# EAGLE board ARK (EAGLE 9.4.2)
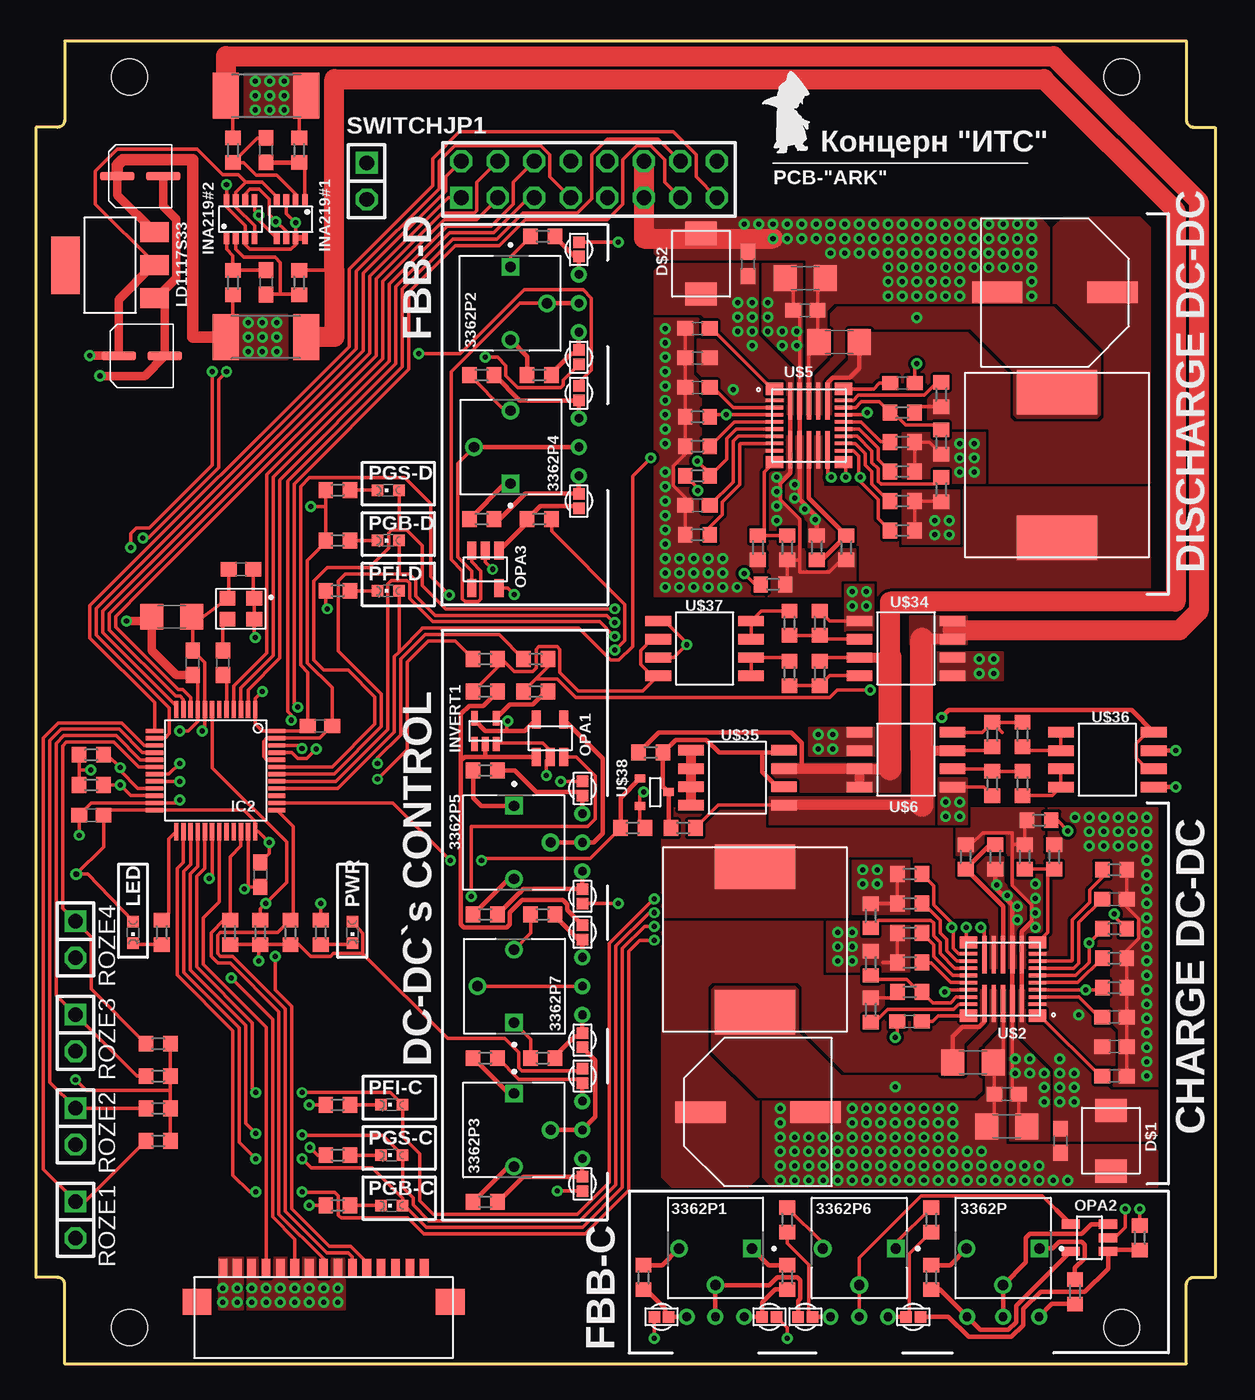
[diagram p5: board, top side]
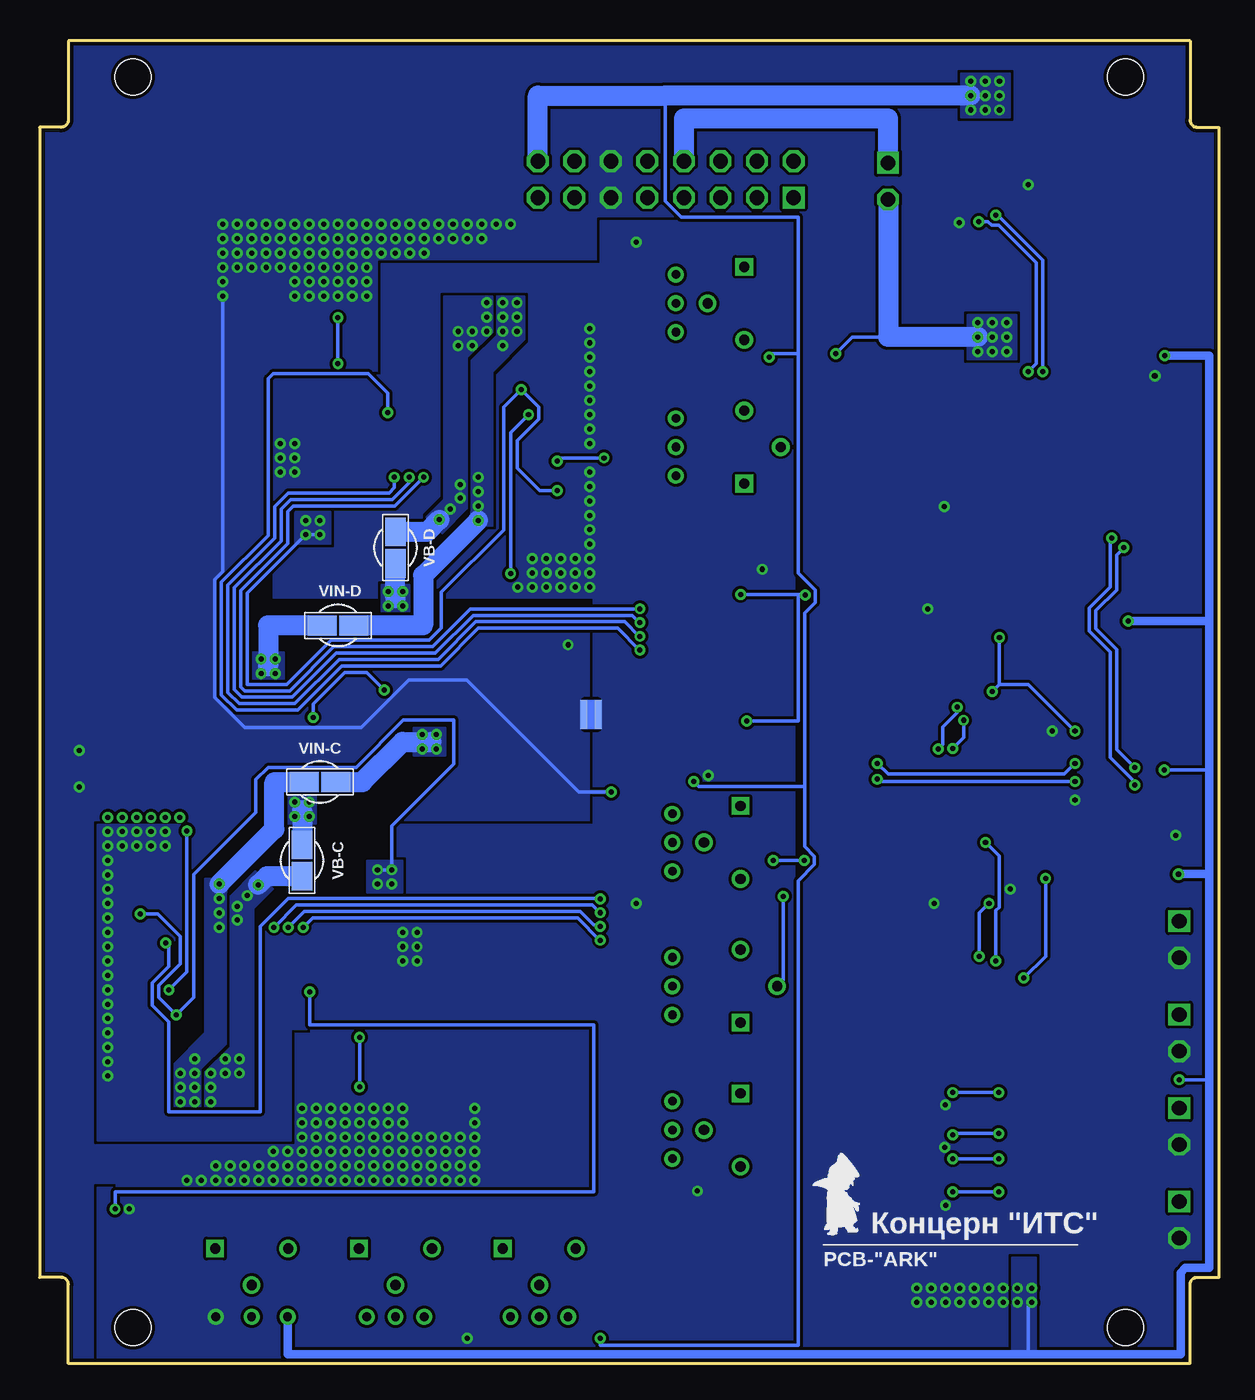
[diagram p6: board, bottom side, seen from below]

Size 82 x 92 mm. Coordinates in mm from the lower left corner, seen from the top.
Outline: 2,92 80,92 80,86.5 arc90 80.5,86 82,86 82,6 80.5,6 arc90 80,5.5 80,0 2,0 2,5.5 arc90 1.5,6 0,6 0,86 1.5,86 arc90 2,86.5 2,92
Copper layers (1*16): Top 0.035mm / dielectric 1.5mm / Bottom 0.035mm
Design rules "default *": minimum track width 0.25mm, minimum drill 0.35mm, track to track 0.2mm, track to pad 0.2mm, pad to pad 0.2mm, via to via 0.2mm, smd to smd 0.2mm, copper to edge 0.25mm, drill to drill 0.2mm, minimum pad ring 10mil, minimum via ring 8mil, stop-mask expansion 4mil, vias tented up to drill 0mil, thermal gap 10mil
Holes 2.5 mm at 6.5,2.5 75.5,2.5 75.5,89.5 6.5,89.5

## Footprints (pad centres in the part's own frame; a part is rotated, then mirrored left to right if it is on the bottom)
TRIM_3362P-1-502LF = drill 0.714 square: 1 -2.54,0 | drill 0.714: 2 0,2.54; 3 2.54,0
C0603 = smd 1.1 x 1: 1 -0.85,0; 2 0.85,0
C1206 = smd 1.6 x 1.8: 1 -1.4,0; 2 1.4,0
ECAP-SMD-D4 = smd 0.6 x 2.4: P+ 0,1.6; P- 0,-1.6
ECAP1000-CMD = smd 1.5 x 3.5: P$1 0,4; P$2 0,-4
SMB = smd 1.62 x 2.18: P$1 -2.11,0; P$2 2.11,0
LQFP48 = smd 0.3 x 1.2: 1 -2.75,-4.25; 2 -2.25,-4.25; 3 -1.75,-4.25; 4 -1.25,-4.25; 5 -0.75,-4.25; 6 -0.25,-4.25; 7 0.25,-4.25; 8 0.75,-4.25; 9 1.25,-4.25; 10 1.75,-4.25; 11 2.25,-4.25; 12 2.75,-4.25; 25 2.75,4.25; 26 2.25,4.25; 27 1.75,4.25; 28 1.25,4.25; 29 0.75,4.25; 30 0.25,4.25; 31 -0.25,4.25; 32 -0.75,4.25; 33 -1.25,4.25; 34 -1.75,4.25; 35 -2.25,4.25; 36 -2.75,4.25 | smd 1.2 x 0.3: 13 4.25,-2.75; 14 4.25,-2.25; 15 4.25,-1.75; 16 4.25,-1.25; 17 4.25,-0.75; 18 4.25,-0.25; 19 4.25,0.25; 20 4.25,0.75; 21 4.25,1.25; 22 4.25,1.75; 23 4.25,2.25; 24 4.25,2.75; 37 -4.25,2.75; 38 -4.25,2.25; 39 -4.25,1.75; 40 -4.25,1.25; 41 -4.25,0.75; 42 -4.25,0.25; 43 -4.25,-0.25; 44 -4.25,-0.75; 45 -4.25,-1.25; 46 -4.25,-1.75; 47 -4.25,-2.25; 48 -4.25,-2.75
SOT23-8 = smd 0.9 x 0.4: 1 -1.3,0.975; 2 -1.3,0.325; 3 -1.3,-0.325; 4 -1.3,-0.975; 5 1.3,-0.975; 6 1.3,-0.325; 7 1.3,0.325; 8 1.3,0.975
SC70 = smd 0.47 x 1: P$1 -0.75,-0.9; P$2 0,-0.9; P$3 0.75,-0.9; P$4 0.75,0.9; P$5 -0.75,0.9
2X08 = drill 1.016 square: 1 -8.89,-1.27 | drill 1.016 octagon: 2 -8.89,1.27; 3 -6.35,-1.27; 4 -6.35,1.27; 5 -3.81,-1.27; 6 -3.81,1.27; 7 -1.27,-1.27; 8 -1.27,1.27; 9 1.27,-1.27; 10 1.27,1.27; 11 3.81,-1.27; 12 3.81,1.27; 13 6.35,-1.27; 14 6.35,1.27; 15 8.89,-1.27; 16 8.89,1.27
L_12X12 = smd 3.1 x 5.6: P$1 -5.05,0; P$2 5.05,0
SOT223 = smd 4 x 2: P$1 0,3.1 | smd 1.4 x 2: P$2 -2.29,-3.1; P$3 0,-3.1; P$4 2.29,-3.1
CHIPLED_0603 = smd 0.8 x 0.8: A 0,-0.75; C 0,0.75
SOT23-5 = smd 0.635 x 1.27: P$1 -0.95,-1.3; P$2 0,-1.3; P$3 0.95,-1.3; P$4 0.95,1.3; P$5 -0.95,1.3
R0603 = smd 1 x 1.1: 1 -0.85,0; 2 0.85,0
R2512 = smd 1.8 x 3.2: 1 -2.8,0; 2 2.8,0
1X02 = drill 1.016 square: 1 -1.27,0 | drill 1.016 octagon: 2 1.27,0
OC2E08000XCCDRX = smd 1.1 x 1: P$1 0.925,0.725; P$2 -0.925,0.725; P$3 -0.925,-0.725; P$4 0.925,-0.725
SOLDERING-PAD-4A = smd 2 x 1.4: P$1 1.1,0; P$2 -1.1,0
QFN-30 = smd 1.2 x 0.85: 1 -2.4,2.55; 10 -2.4,-2.55; 16 2.4,-2.55; 25 2.4,2.55 | smd 1.2 x 0.25: 2 -2.4,1.75; 3 -2.4,1.25; 4 -2.4,0.75; 5 -2.4,0.25; 6 -2.4,-0.25; 7 -2.4,-0.75; 8 -2.4,-1.25; 9 -2.4,-1.75; 17 2.4,-1.75; 18 2.4,-1.25; 19 2.4,-0.75; 20 2.4,-0.25; 21 2.4,0.25; 22 2.4,0.75; 23 2.4,1.25; 24 2.4,1.75 | smd 0.3 x 2.6: 11 -1.3,-1.7; 12 -0.65,-1.7; 13 0,-1.7; 14 0.65,-1.7; 15 1.3,-1.7; 26 1.3,1.7; 27 0.65,1.7; 28 0,1.7; 29 -0.65,1.7; 30 -1.3,1.7
SO8 = smd 0.72 x 1.78: 1 -1.905,-3.23; 2 -0.635,-3.23; 3 0.635,-3.23; 4 1.905,-3.23; 5 1.905,3.23; 6 0.635,3.23; 7 -0.635,3.23; 8 -1.905,3.23
GNDS-CONNECTOR = smd 0.5 x 2: P$1 -0.5,0; P$2 0.5,0
VIAS = drill 0.6: P$1 0,0
68611 = smd 0.6 x 1.3: P$1 -7,0.65; P$2 -6,0.65; P$3 -5,0.65; P$4 -4,0.65; P$5 -3,0.65; P$6 -2,0.65; P$7 -1,0.65; P$8 0,0.65; P$9 1,0.65; P$10 2,0.65; P$11 3,0.65; P$12 4,0.65; P$13 5,0.65; P$14 6,0.65; P$15 7,0.65 | smd 2 x 1.8: P$16 8.8,-1.7; P$17 -8.8,-1.7
VIAS-CONNECT = smd 0.8 x 0.8: 1 -0.5,0; 2 0.5,0
SOT23-3 = smd 0.56 x 0.73: 1 -0.95,-1; 2 0.95,-1; 3 0,1

## Placement (x,y rotation side)
3362P  1k  [TRIM_3362P-1-502LF]  67.25,8 180 top
3362P1  1k  [TRIM_3362P-1-502LF]  47.25,8 180 top
3362P2  5k  [TRIM_3362P-1-502LF]  33,73.75 270 top
3362P3  500R  [TRIM_3362P-1-502LF]  33.25,16.25 270 top
3362P4  1k  [TRIM_3362P-1-502LF]  33,63.75 90 top
3362P5  5k  [TRIM_3362P-1-502LF]  33.25,36.25 270 top
3362P6  20k  [TRIM_3362P-1-502LF]  57.25,8 180 top
3362P7  20k  [TRIM_3362P-1-502LF]  33.25,26.25 90 top
C1  1nF  [C0603]  13,48.75 90 top
C1.C  100nF  [C0603]  71.25,15.5 90 top
C1.D  100nF  [C0603]  49.5,76.5 270 top
C2  10nF  [C0603]  14.25,55.25 0 top
C2A.C  22µF  [C1206]  67.5,16.5 180 top
C2A.D  22µF  [C1206]  53.5,75.5 0 top
C2B.C  100nF  [C0603]  67.5,18.75 180 top
C2B.D  100nF  [C0603]  53.5,73.25 0 top
C3.C  1µF  [C0603]  75,22.05 0 top
C3.D  1µF  [C0603]  46,69.95 180 top
C4  10uF  [ECAP-SMD-D4]  7.35,70.1 90 top
C4A.C  1µF  [C1206]  65.15,20.95 180 top
C4A.D  1µF  [C1206]  55.85,71.05 0 top
C4B.C  1000µF  [ECAP1000-CMD]  50.2,17.5 90 top
C4B.D  1000µF  [ECAP1000-CMD]  70.85,74.5 270 top
C5  100nF  [C0603]  19.75,44.35 0 top
C5.C  1µF  [C0603]  60.75,23.8 0 top
C5.D  1µF  [C0603]  60.25,68.2 180 top
C6  100nF  [C0603]  10.9,48.75 90 top
C6.C  10nF  [C0603]  75,20 0 top
C6.D  10nF  [C0603]  46,72 180 top
C7  100nF  [C0603]  3.85,38.15 180 top
C7.C  (10nF)  [C0603]  75,24.1 0 top
C7.D  (10nF)  [C0603]  46,67.9 180 top
C8  100nF  [C0603]  15.6,34 270 top
C8.C  (10nF)  [C0603]  75,32.3 0 top
C8.D  (10nF)  [C0603]  46,59.7 180 top
C9  0,1µ  [C0603]  16,84.4 90 top
C10  0,1µ  [C0603]  16,75.2 270 top
C11  1uF  [ECAP-SMD-D4]  7.25,82.6 90 top
C16  10µ  [C1206]  9.45,51.95 0 top
D$1  SMP100LC-8  [SMB]  74.75,15.5 90 top
D$2  SMP100LC-8  [SMB]  46.25,76.5 270 top
IC2  STM32F103C8T  [LQFP48]  12.5,41.25 180 top
INA219#1  INA219AID  [SOT23-8]  17.73,79.6 270 top
INA219#2  INA219AID  [SOT23-8]  14.22,79.6 90 top
INVERT1  INVERTER.  [SC70]  31.25,44 0 top
JP1  [2X08]  38.46,82.37 0 top
L1.C  10µH  [L_12X12]  50,29.5 90 top
L1.D  10µH  [L_12X12]  71,62.5 270 top
LD1117S33  LD1117S33  [SOT223]  5.15,76.4 90 top
LED  [CHIPLED_0603]  6.75,30 180 top
OPA1  OPA333  [SOT23-5]  35.75,43.5 0 top
OPA2  OPA333  [SOT23-5]  73.25,8.75 90 top
OPA3  OPA333  [SOT23-5]  31.25,55.25 180 top
PFI-C  [CHIPLED_0603]  24.75,18 90 top
PFI-D  [CHIPLED_0603]  24.5,53.75 90 top
PGB-C  [CHIPLED_0603]  24.75,11 90 top
PGB-D  [CHIPLED_0603]  24.5,57.25 90 top
PGS-C  [CHIPLED_0603]  24.75,14.5 90 top
PGS-D  [CHIPLED_0603]  24.5,60.75 90 top
PWR  [CHIPLED_0603]  22,30 180 top
R1  10k  [R0603]  34.75,46.75 180 top
R1.C  62k  [R0603]  68.75,35.25 270 top
R1.D  62k  [R0603]  52.25,56.75 90 top
R2  10k  [R0603]  8.5,15.5 0 top
R2.C  10k  [R0603]  70.8,35.25 90 top
R2.D  10k  [R0603]  50.2,56.75 270 top
R3  100  [R0603]  34.75,49 0 top
R4  100  [R0603]  52.4,48 90 top
R5  100  [R0603]  52.4,51.5 90 top
R5.C  191k  [R0603]  60.75,25.85 0 top
R5.D  191k  [R0603]  60.25,66.15 180 top
R6  10k  [R0603]  8.5,17.75 0 top
R6.C  10k  [R0603]  58.05,27.85 90 top
R6.D  10k  [R0603]  62.95,64.1 270 top
R7  100  [R0603]  68.6,43.75 90 top
R7.C  17k8  [R0603]  75,34.35 180 top
R7.D  17k8  [R0603]  46,57.65 0 top
R8  10k  [R0603]  8.5,20 0 top
R8.C  (10k)  [R0603]  58.05,24.6 270 top
R8.D  (10k)  [R0603]  62.95,67.4 90 top
R9  10k  [R0603]  52.25,10 90 top
R9.C  200k  [R0603]  69.75,37.8 0 top
R9.D  200k  [R0603]  51.25,54.2 180 top
R10  10k  [R0603]  62.25,10 270 top
R10.C  11k  [R0603]  75,26.15 0 top
R10.D  11k  [R0603]  46,65.85 180 top
R11  34k8  [R0603]  62.25,6 270 top
R11.C  100k  [R0603]  64.65,35.25 90 top
R11.D  100k  [R0603]  56.35,56.75 270 top
R12  10k  [R0603]  72.25,5 90 top
R12.C  100k  [R0603]  66.7,35.25 90 top
R12.D  100k  [R0603]  54.3,56.75 270 top
R13  91k  [R0603]  42.25,6 270 top
R13.C  100k  [R0603]  75,28.2 180 top
R13.D  100k  [R0603]  46,63.8 0 top
R14  10k  [R0603]  52.25,6 90 top
R14.C  100k  [R0603]  75,30.25 180 top
R14.D  100k  [R0603]  46,61.75 0 top
R15  10k  [R0603]  76.75,8.75 90 top
R15.C  100k  [R0603]  60.75,34.05 180 top
R15.D  100k  [R0603]  60.25,57.95 0 top
R16  2k  [R0603]  21,18 0 top
R16.C  10k  [R0603]  60.75,32 180 top
R16.D  10k  [R0603]  60.25,60 0 top
R17  2k  [R0603]  21,14.5 0 top
R17.C  10k  [R0603]  58.05,31.15 90 top
R17.D  10k  [R0603]  62.95,60.8 270 top
R18  2k  [R0603]  21,11 0 top
R18.C  51k  [R0603]  60.75,27.9 180 top
R18.D  51k  [R0603]  60.25,64.1 0 top
R19  51k  [R0603]  31,68.75 180 top
R19.C  (1M)  [R0603]  60.75,29.95 180 top
R19.D  (1M)  [R0603]  60.25,62.05 0 top
R20  51k  [R0603]  35,68.75 0 top
R21  10k  [R0603]  35.25,78.4 180 top
R22  2k  [R0603]  31,58.75 0 top
R23  2k  [R0603]  21,53.75 0 top
R24  2k  [R0603]  21,60.75 0 top
R25  10k  [R0603]  35,58.75 0 top
R26  2k  [R0603]  21,57.25 0 top
R27  10k  [R0603]  17.7,30 90 top
R28  100  [R0603]  68.6,40.35 90 top
R29  10k  [R0603]  66.5,43.75 90 top
R31  10k  [R0603]  66.5,40.35 90 top
R34  10k  [R0603]  54.5,48 270 top
R35  10k  [R0603]  54.5,51.5 270 top
R38  10k  [R0603]  31.25,46.75 0 top
R39  100  [R0603]  31.25,49 180 top
R40  10k  [R0603]  42.75,42.5 0 top
R41  10k  [R0603]  45,37.25 180 top
R42  10k  [R0603]  41.5,37.25 180 top
R43  2k  [R0603]  31.25,11.25 0 top
R44  1k  [R0603]  31.25,21.25 180 top
R45  10k  [R0603]  31.25,31.25 0 top
R46  24k9  [R0603]  31.25,41.25 180 top
R47  620k  [R0603]  35.25,31.25 180 top
R48  10k  [R0603]  35.25,21.25 0 top
R49  10k  [R0603]  8.5,22.25 0 top
R64  10k  [R0603]  13.5,30 90 top
R71  R01  [R2512]  16,88.2 0 top
R73  10R  [R0603]  18.3,84.4 270 top
R74  10R  [R0603]  13.7,84.4 270 top
R75  R01  [R2512]  16,71.4 180 top
R76  10R  [R0603]  13.7,75.2 90 top
R77  10R  [R0603]  18.3,75.2 270 top
R79  10k  [R0603]  15.6,30 90 top
R81  2k  [R0603]  8.75,30 270 top
R82  2k  [R0603]  19.8,30 270 top
R101  5k1  [R0603]  3.85,42.35 0 top
R102  5k1  [R0603]  3.85,40.25 0 top
ROZE1  [1X02]  2.75,10 270 top
ROZE2  [1X02]  2.75,16.5 270 top
ROZE3  [1X02]  2.75,23 270 top
ROZE4  [1X02]  2.75,29.5 270 top
SWITCH  [1X02]  23,82.25 270 top
TCXO  OC2E08000XCCDRX  [OC2E08000XCCDRX]  14.25,52.5 0 top
U$1  VIN-C  [SOLDERING-PAD-4A]  62.5,40.45 0 bottom
U$2  MP5515  [QFN-30]  67.25,26.75 180 top
U$3  PCB-"ARK"  [ITS-LOGO]  51.25,83.5 0 top
U$4  PCB-"ARK"  [ITS-LOGO]  27.5,8.25 0 bottom
U$5  MP5515  [QFN-30]  53.75,65.25 0 top
U$6  IRF7329PBF  [SO8]  60.5,42 90 top
U$7  GNDS-CONNECTOR  [GNDS-CONNECTOR]  43.65,45.15 0 bottom
U$9  [VIAS]  37.75,61.75 270 top
U$10  IN-  [VIAS]  37.75,63.75 270 top
U$11  [VIAS]  37.75,65.75 270 top
U$12  FFC-CONNECT68611  [68611]  20,6 0 top
U$13  OUT  [VIAS-CONNECT]  37.75,60 90 top
U$14  BMS+  [VIAS-CONNECT]  37.75,67.5 270 top
U$15  BUS+  [VIAS-CONNECT]  37.75,70 270 top
U$16  AGND  [VIAS-CONNECT]  37.75,77.5 270 top
U$17  [VIAS]  37.75,75.75 270 top
U$18  [VIAS]  37.75,71.75 270 top
U$19  IN+  [VIAS]  37.75,73.75 270 top
U$20  AGND  [VIAS-CONNECT]  51,3.25 0 top
U$21  BUS+  [VIAS-CONNECT]  43.5,3.25 0 top
U$22  [VIAS]  49.25,3.25 0 top
U$23  VB-C  [SOLDERING-PAD-4A]  63.75,35 90 bottom
U$24  [VIAS]  45.25,3.25 0 top
U$25  REF  [VIAS]  47.25,3.25 0 top
U$26  REF  [VIAS-CONNECT]  53.5,3.25 0 top
U$27  [VIAS]  55.25,3.25 0 top
U$28  IN-  [VIAS]  57.25,3.25 0 top
U$29  OUT  [VIAS-CONNECT]  61,3.25 180 top
U$30  [VIAS]  59.25,3.25 0 top
U$31  3V3  [VIAS]  64.75,3.25 0 top
U$32  IN+  [VIAS]  67.25,3.25 0 top
U$33  AGND  [VIAS]  69.75,3.25 0 top
U$34  IRF7329PBF  [SO8]  60.5,49.75 270 top
U$35  IRF7329PBF  [SO8]  48.77,40.75 90 top
U$36  IRF7905PBF  [SO8]  74.5,42 90 top
U$37  IRF7905PBF  [SO8]  46.5,49.75 270 top
U$38  SI2302CDS  [SOT23-3]  43,39.75 270 top
U$39  AGND  [VIAS-CONNECT]  38,12.5 270 top
U$40  3V3  [VIAS-CONNECT]  38,20 270 top
U$41  [VIAS]  38,18.25 270 top
U$42  [VIAS]  38,14.25 270 top
U$43  REF  [VIAS]  38,16.25 270 top
U$44  AGND  [VIAS-CONNECT]  38,32.5 270 top
U$45  BUS+  [VIAS-CONNECT]  38,40 270 top
U$46  [VIAS]  38,38.25 0 top
U$47  [VIAS]  38,34.25 0 top
U$48  IN-  [VIAS]  38,36.25 0 top
U$49  OUT-D  [VIAS-CONNECT]  38,30 270 top
U$50  [VIAS]  38,28.25 90 top
U$51  IN+  [VIAS]  38,26.25 90 top
U$52  REF  [VIAS-CONNECT]  38,22.5 90 top
U$53  [VIAS]  38,24.25 90 top
U$54  VIN-D  [SOLDERING-PAD-4A]  61.25,51.35 180 bottom
U$55  VB-D  [SOLDERING-PAD-4A]  57.25,56.75 270 bottom

## Tracks (layer width: path | path; a pad name or v marks a point on that pad's centre or on a via)
0V8
  Top 0.3: U$32.P$1 3362P.2 68.83,7.04 68.83,8.76 69.11,9.03 72.73,9.03 73.4,9.7 OPA2.P$3
1W
  Top 0.25: IC2.14 8.28,43.52 8.98,43.52 9.28,43.81 9.28,45.59 4.2,50.66 4.2,52.54 22.27,70.61 22.27,75.98 28.03,81.74 28.03,83.64 29.12,84.73 35.1,84.73 35.74,84.09 35.74,82.55 JP1.7
3V3  (via drill 0.35, 0.4)
  Top 0.25: 14.6,82.17 13.9,81.47 INA219#2.7 13.9,80.44 15.2,79.14 INA219#2.4 | INA219#1.4 16.75,81.17 15.74,82.17 14.6,82.17 | U$40.1 37.88,20.38 33.77,20.38 33.58,20.57 33.58,21.65 32.61,22.61 28.64,22.61 22.7,28.55 | C6.1 11.25,47.55 IC2.9 11.25,44.67 10.58,44 v10,44 | v3.8,41.3 3,41.3 | 3,41.3 R101.1 | 3,41.3 R102.1 | C2.2 15.1,53.23 TCXO.P$1 TCXO.P$4 15.18,50.58 v15.25,50.5 | R49.2 R8.2 9.35,19 | R64.1 R79.1 | R79.1 R27.1 18.29,29.15 19.11,28.32 20.48,28.32 20.68,28.52 22.68,28.52 22.7,28.55 | LED.A 3.6,34.05 v2.8,34.05 4.7,35.95 C7.1 5.05,38.5 IC2.24 14.46,38.5 15.22,37.73 15.22,37.02 IC2.36 15.47,37 v16.22,36.25 16.22,35.47 C8.1 | 22.7,28.55 22.73,28.57 22.73,29.91 PWR.A | OPA3.P$5 32.8,53.95 v33.25,53.5 | 32.75,44 32.75,44.62 v32.81,44.69 | LD1117S33.P$3 8.25,76.53 4.12,80.66 4.12,82.95 5.65,84.47 11.2,84.47 12.97,82.7 14.07,82.7 14.6,82.17 | v15.75,46.75 15.25,46.25 IC2.1 15.25,44.5 15.75,44 IC2.48 18.55,44 C5.1 18.9,48.08 18.4,48.58 18.4,61.01 19.02,61.62 25.64,61.62 27.44,59.82 27.44,54.76 v28.75,53.45 | R79.1 15.5,29.05 v15.5,28 | R2.2 R6.2 9.35,19 | v2.75,19.75 3.5,19 9.35,19
  Top 0.3: OPA2.P$5 68.15,4 68.15,2.88 67.62,2.35 65.65,2.35 U$31.P$1 62.85,5.15 R11.2 | INVERT1.P$5 30.5,44.75 31.25,44 32.75,44 34,44 OPA1.P$5
  Top 0.6: LD1117S33.P$3 8.13,76.4 5.75,74.02 C4.P+ v3.75,70.1 | v6.3,51.65 7.75,51.65 C16.1 8.05,49.61 9.76,47.9 C6.1
  Bottom 0.25: v3.8,41.3 0.65,41.3 | v33.25,53.5 29.25,53.5 | 29.25,53.5 28.8,53.5 v28.75,53.45 | v32.81,44.69 29.25,44.69 29.25,53.5 | v15.25,50.5 15.25,47.25 | 15.25,47.25 v15.75,46.75 | v10,44 13.25,47.25 15.25,47.25 | v15.5,28 15.5,31.51 15.28,31.73 15.28,35.3 v16.22,36.25 | v2.75,19.75 0.65,19.75 | v13,4.25 13.25,4 13.25,0.65
  Bottom 0.6: U$31.P$1 64.75,0.65 13.25,0.65 2.65,0.65 2.65,6.33 2.33,6.65 0.65,6.65 0.65,19.75 0.65,34.05 | v3.75,70.1 0.65,70.1 0.65,51.65 | 0.65,34.05 0.65,41.3 0.65,51.65 | v2.8,34.05 0.65,34.05 | v6.3,51.65 0.65,51.65
  other vias: 14,5.25 13,5.25 14,4.25
  pour Top (no thermals): 12.7,7.4 14.4,7.4 14.4,3.75 12.7,3.75
  pour Bottom (no thermals): 12.7,7.4 14.4,7.4 14.4,0.3 12.7,0.3
A
  Top 0.3: 31.25,42.2 29.8,42.2 29.55,41.95 | 31.25,42.2 32,42.2 OPA1.P$1 | U$49.1 36.95,31.55 36.95,31.95 36.65,32.25 33.81,32.25 32.95,31.39 32.95,30.55 32.74,30.35 29.75,30.35 29.55,30.55 29.55,41.95 | INVERT1.P$2 31.25,42.2 | R38.2 31.1,45.75 30.12,45.75 29.55,45.18 29.55,41.95
AGND  (via drill 0.35)
  Top 0.25: R19.D.2 R18.D.2 62.1,64.1 R6.D.2 | C6.D.2 C3.D.2 C7.D.2 R10.D.2 R13.D.1 45.15,63.26 44.33,62.44 44.33,61.06 45.15,60.24 C8.D.2 R7.D.1 | R19.C.2 R18.C.2 58.9,27.9 | C6.C.2 C3.C.2 C7.C.2 R10.C.2 R13.C.1 75.85,28.74 76.67,29.57 76.67,30.93 75.85,31.76 C8.C.2 R7.C.1 | OPA3.P$2 31.25,55.75 v31.75,55.25 | U$39.2 v36.25,12 | v75.75,10.75 75.75,9.49 75.01,8.75 OPA2.P$2 | v35.5,40.9 35.5,41.95 OPA1.P$2 35.75,42.66 35.25,43.16 32.06,43.16 INVERT1.P$3 | R12.1 72.25,4.53 | U$44.2 v40.5,32 | U$16.1 v40.5,78 | U$20.2 52.25,2.5 v52.25,1.75
  Top 0.3: R12.1 70.65,4.15 U$33.P$1 69.75,3.06
  other vias: 64.25,62 65.25,62 65.25,63 64.25,63 64.25,64 65.25,64 43.75,71 43.75,72 43.75,70 43.75,68 43.75,69 43.75,67 43.75,65 43.75,66 43.75,64 43.75,62 43.75,61 43.75,59 43.75,60 43.75,58 43.75,56 43.75,57 43.75,55 43.75,54 44.75,56 44.75,55 44.75,54 45.75,56 45.75,55 45.75,54 46.75,56 46.75,55 46.75,54 47.75,56 47.75,55 47.75,54 48.75,54 56.75,30 55.75,30 55.75,29 56.75,29 56.75,28 55.75,28 77.25,21 77.25,20 77.25,22 77.25,24 77.25,23 77.25,25 77.25,27 77.25,26 77.25,28 77.25,30 77.25,29 77.25,31 77.25,33 77.25,32 77.25,34 77.25,36 77.25,35 77.25,37 77.25,38 76.25,36 76.25,37 76.25,38 75.25,36 75.25,37 75.25,38 74.25,36 74.25,37 74.25,38 73.25,36 73.25,37 73.25,38 72.25,38
  pour Top (rank 3, no thermals): 52,63.75 52,63.25 51,63.25 51,53.35 43,53.35 43,73.25 46.25,73.25 46.25,63.75
  pour Top (no thermals): 60.25,64.75 66,64.75 66,61.25 60.25,61.25
  pour Top (rank 3, no thermals): 69,28.25 69,28.75 70,28.75 70,38.65 78,38.65 78,18.75 74.75,18.75 74.75,28.25
  pour Top (no thermals): 60.75,27.25 55,27.25 55,30.75 60.75,30.75
  pour Bottom (rank 3, no thermals): 43,76.5 58.25,76.5 58.25,68.75 65.75,68.75 65.75,53.25 43.5,53.25 43.5,37.5 78,37.5 78,15.5 64.5,15.5 64.5,23.25 43.5,23.25 43.5,12.25 78,12.25 78,0 29.5,0 29.5,79.5 43,79.5
BMS1
  Top 0.25: JP1.1 28.67,81.1 23.23,75.66 23.23,70.29 5.1,52.16 5.1,51.04 9.71,46.42 10.04,46.42 10.25,46.21 IC2.11
BMS2
  Top 0.25: IC2.12 9.75,45.75 4.65,50.85 4.65,52.35 22.77,70.47 22.77,75.84 28.48,81.55 28.48,82.55 JP1.2
BMS3
  Top 0.25: IC2.4 13.75,47.14 16.05,49.44 16.05,61.84 24.12,69.92 24.12,75.28 28.41,79.56 30.65,79.56 32.11,81.02 JP1.3
BMS4
  Top 0.25: JP1.4 30.66,82.19 30.66,80.2 30.47,80.01 28.22,80.01 23.68,75.47 23.68,70.1 7.54,53.96 5.55,51.98 5.55,51.22 9.9,46.88 10.22,46.88 10.75,46.35 IC2.10
BMS5
  Top 0.25: IC2.2 14.75,46.87 16.95,49.07 16.95,61.47 25.02,69.54 25.02,74.91 28.78,78.66 31.85,78.66 34.28,81.1 JP1.5
BMS6
  Top 0.25: JP1.6 33.2,82.19 33.2,80.65 31.66,79.11 28.59,79.11 24.57,75.1 24.57,69.73 16.5,61.66 16.5,49.25 14.25,47 IC2.3
BMS+  (via drill 0.35)
  Top 0.25: R76.1 13.7,71.4 R75.2 | v26.63,70.25 29.5,70.25 33.94,74.69 38.06,74.69 38.63,74.11 38.63,69.12 37.75,68.24 U$14.1
  Top 0.6: LD1117S33.P$4 5.65,81.29 C11.P+
  Top 0.8: C11.P+ 5.65,83.35 6.05,83.75 10.9,83.75 10.9,71.4 R75.2
  Bottom 0.25: v26.63,70.25 25.48,71.4 23,71.4
  Bottom 1.4: SWITCH.2 23,71.4 v16.75,71.4
  other vias: 14.75,71.4 15.75,71.4 16.75,70.4 15.75,70.4 14.75,70.4 14.75,72.4 15.75,72.4 16.75,72.4
  pour Bottom (no thermals): 14.05,69.85 17.5,69.85 17.5,72.95 14.05,72.95
  pour Top (no thermals): 12.3,69.85 12.3,72.95 17.5,72.95 17.5,69.85
BMS+_OUT
  Bottom 1.4: SWITCH.1 23,86.6 37.19,86.6 JP1.8
BUS+  (via drill 0.35)
  Top 0.25: R73.1 18.3,87.7 R71.2 | v43,1.75 U$21.1 | v36.5,40.5 U$45.1 | U$15.2 36.67,68.42 36.67,68.06 36.48,67.88 33.52,67.88 32.67,68.72 32.67,69.44 32.11,70 v31.25,70
  Bottom 0.25: 38.5,88.2 38.5,80.87 37.38,79.75 29.25,79.75 29.25,70.25 | v43,1.75 43,1.27 29.25,1.27 29.25,33.58 28.12,34.71 28.12,35.29 28.8,35.97 28.8,40.15 | 29.25,70.25 29.25,55 28.05,53.8 28.05,52.95 28.8,52.2 28.8,40.15 | 28.8,40.15 36.15,40.15 v36.5,40.5 | 29.25,70.25 31,70.25 v31.25,70
  Bottom 1.4: JP1.16 47.35,88.2 38.5,88.2 v17.25,88.2
  other vias: 16.25,88.2 15.25,89.2 16.25,89.2 17.25,89.2 15.25,88.2 17.25,87.2 16.25,87.2 15.25,87.2
  pour Bottom (no thermals): 17.95,89.75 14.5,89.75 14.5,86.65 17.95,86.65
  pour Top (no thermals): 19.7,89.75 19.7,86.65 14.5,86.65 14.5,89.75
C-OFF  (via drill 0.35)
  Top 0.25: IC2.19 9.25,41 v10,41.75 | v23.75,41.75 23.75,42.11 25.38,43.74 25.38,49 27.07,50.7 32.2,50.7 R3.1
  Bottom 0.25: v23.75,41.75 23,41 10.75,41 v10,41.75
D-OFF  (via drill 0.35)
  Top 0.25: R39.2 29.15,50.25 27.26,50.25 25.82,48.81 25.82,42.73 v23.75,40.65 | v10,40.5 IC2.20
  Bottom 0.25: v23.75,40.65 23.6,40.5 v10,40.5
DC-DC  (via drill 0.35)
  Top 0.25: R42.2 38.53,35.13 31.11,35.13 v30.98,35 | IC2.38 24.82,39 v28.82,35
  Top 0.3: R42.2 40.65,39.35 U$38.1
  Bottom 0.25: v28.82,35 v30.98,35
FBB-C  (via drill 0.35)
  Top 0.25: U$2.22 63.35,26 v63.2,25.85 | v76.75,10.75 R15.2
  Bottom 0.25: v63.2,25.85 63.2,23.55 43.45,23.55 43.45,11.95 76.75,11.95 v76.75,10.75
FBB-D  (via drill 0.35)
  Top 0.25: U$5.22 57.65,66 v57.8,66.15 | R25.2 35.85,57.89 40.95,52.79 40.95,50.3 40.29,49.63 v40.25,49.63
  Bottom 0.25: v57.8,66.15 57.8,67.5 59.15,68.85 65.75,68.85 66.1,68.5 66.1,57.6 69.35,54.35 69.35,46.5 68.3,45.45 64.06,45.45 60.98,48.52 54.1,48.52 51.48,51.15 41.81,51.15 40.29,49.63 v40.25,49.63
GND  (via drill 0.35, 0.4)
  Top 0.25: U$5.28 53.75,70.35 C4A.D.1 54.35,71.15 C2B.D.2 54.35,76.05 C2A.D.2 | U$2.28 67.25,21.65 C4A.C.1 66.65,20.85 66.65,15.95 C2A.C.2 | INA219#1.3 17.4,80 v18.05,79.35 INA219#1.7 18.05,77.84 17.73,77.53 14.87,77.53 14.55,77.84 INA219#2.3 14.55,79.14 13.25,80.44 INA219#2.8 v13.25,82 | v42.25,39.75 42,39.5 U$38.2 42,37.6 R42.1 | IC2.35 14.75,33.25 14.65,33.15 | C2.1 13.4,53.23 TCXO.P$2 11.18,51.62 C16.2 10.9,51.9 C6.2 11.75,48.75 IC2.8 11.75,44.18 v11.57,44 | R82.1 v19.8,32 | v3,36.75 C7.2 3.85,39 IC2.23 9.8,39 v10,39.2 | 42.27,78 42.27,78.25 | R16.1 v19.01,18 | R17.1 19.61,14.5 v19.05,15.05 | R18.1 v19,11 | C8.2 14.65,33.15 | 14.65,33.15 v14.5,33 | IC2.44 16.04,42 15.82,42.22 15.82,43.28 16.04,43.5 IC2.47 19.75,43.5 C5.2 20.6,47.01 18.88,48.74 18.88,55.87 20.15,57.15 R26.1 20.15,59.6 | R23.1 20.15,52.6 v20.25,52.5 | v19.1,59.6 20.15,59.6 | 20.15,59.6 R24.1 | U$37.1 43.71,51.66 45.25,50.12 v45.25,50 44.37,49.12 U$37.3
  Top 0.3: U$36.3 v79.25,42.65 | U$36.1 v79.25,40.09 v79.25,40.1
  Top 0.4: INA219#1.8 INA219#1.7
  Top 0.6: C11.P- 8.85,80.5 9.75,79.6 9.75,75.49 8.37,74.11 LD1117S33.P$2 8.95,74.11 C4.P- 7.55,68.7 v4.45,68.7
  Top 1.4: JP1.12 JP1.11 42.27,78.25 v51.25,78.25
  Bottom 0.25: v42.25,39.75 44.5,39.75 52.31,47.56 56.32,47.56 59.63,44.25 67.73,44.25 69.8,46.32 69.8,54.53 69.25,55.08 v69.25,74.25
  other vias: 49.25,79.25 50.25,79.25 51.25,79.25 52.25,79.25 53.25,79.25 54.25,79.25 55.25,78.25 56.25,78.25 57.25,78.25 58.25,78.25 59.25,78.25 60.25,78.25 55.25,79.25 56.25,79.25 57.25,79.25 58.25,79.25 59.25,79.25 60.25,79.25 55.25,77.25 56.25,77.25 57.25,77.25 58.25,77.25 59.25,77.25 60.25,77.25 61.25,78.25 62.25,78.25 63.25,78.25 64.25,78.25 65.25,78.25 66.25,78.25 61.25,79.25 62.25,79.25 63.25,79.25 64.25,79.25 65.25,79.25 66.25,79.25 61.25,77.25 62.25,77.25 63.25,77.25 64.25,77.25 65.25,77.25 66.25,77.25 52.25,78.25 53.25,78.25 54.25,78.25 59.25,75.25 60.25,75.25 59.25,76.25 60.25,76.25 59.25,74.25 60.25,74.25 61.25,75.25 62.25,75.25 63.25,75.25 64.25,75.25 61.25,76.25 62.25,76.25 63.25,76.25 64.25,76.25 65.25,76.25 66.25,76.25 61.25,74.25 62.25,74.25 63.25,74.25 64.25,74.25 67.25,78.25 68.25,78.25 69.25,78.25 67.25,79.25 68.25,79.25 69.25,79.25 67.25,77.25 68.25,77.25 69.25,77.25 67.25,76.25 68.25,76.25 69.25,76.25 69.25,75.25 70.75,12.75 69.75,12.75 68.75,12.75 67.75,12.75 66.75,12.75 65.75,13.75 64.75,13.75 63.75,13.75 62.75,13.75 61.75,13.75 60.75,13.75 65.75,12.75 64.75,12.75 63.75,12.75 62.75,12.75 61.75,12.75 60.75,12.75 65.75,14.75 64.75,14.75 63.75,14.75 62.75,14.75 61.75,14.75 60.75,14.75 59.75,13.75 58.75,13.75 57.75,13.75 56.75,13.75 55.75,13.75 54.75,13.75 59.75,12.75 58.75,12.75 57.75,12.75 56.75,12.75 55.75,12.75 54.75,12.75 59.75,14.75 58.75,14.75 57.75,14.75 56.75,14.75 55.75,14.75 54.75,14.75 69.75,13.75 68.75,13.75 67.75,13.75 66.75,13.75 63.75,16.75 62.75,16.75 61.75,16.75 60.75,16.75 63.75,15.75 62.75,15.75 61.75,15.75 60.75,15.75 63.75,17.75 62.75,17.75 61.75,17.75 60.75,17.75 59.75,16.75 58.75,16.75 57.75,16.75 56.75,16.75 59.75,15.75 58.75,15.75 57.75,15.75 56.75,15.75 55.75,15.75 54.75,15.75 59.75,17.75 58.75,17.75 57.75,17.75 56.75,17.75 53.75,13.75 52.75,13.75 51.75,13.75 53.75,12.75 52.75,12.75 51.75,12.75 53.75,14.75 52.75,14.75 51.75,14.75 53.75,15.75 52.75,15.75 51.75,15.75 51.75,16.75 51.75,17.75 16,5.25 15,5.25 15,4.25 16,4.25 18,5.25 17,5.25 17,4.25 18,4.25 20,5.25 19,5.25 19,4.25 20,4.25 21,5.25 21,4.25 71.75,12.75
  pour Top (rank 3, no thermals): 53.5,66 54,66 54,68.75 55.5,70.25 55.5,73.5 70.75,73.5 70.75,78.75 69.75,79.75 43,79.75 43,77.25 43.75,76.5 53.5,76.5
  pour Top (rank 3, no thermals): 67.5,26 67,26 67,23.25 65.5,21.75 65.5,18.5 50.25,18.5 50.25,13.25 51.25,12.25 78,12.25 78,14.75 77.25,15.5 67.5,15.5
  pour Top (rank 2, no thermals): 14.6,7.4 21.5,7.4 21.5,3.75 14.6,3.75
  pour Bottom (rank 4, no thermals): -0.25,92.25 -0.25,-0.25 82.25,-0.25 82.25,92.25
INA_BMS+
  Top 0.25: R34.1 54.77,49.12 57,49.12 U$34.3 | R77.1 20.75,76.05
  Top 0.3: 53.25,41.37 53.24,41.37 53.24,43.16 52.52,43.89 43.29,43.89 R40.1
  Top 0.7: U$6.8 U$6.7 | 57,49.12 59.4,49.12 | U$6.7 59.4,41.37 | U$6.7 53.25,41.37 52.02,41.37 U$35.3
  Top 1.4: 59.4,49.12 59.4,53 79.25,53 79.25,80.19 70.09,89.35 20.75,89.35 20.75,76.05 20.75,71.4 R75.1
  Top 1.6: 59.4,41.37 59.4,49.12
  pour Top (no thermals): 51.25,41.75 60.15,41.75 60.15,39.75 51.25,39.75
INA_BUS+
  Top 0.25: R29.1 66.23,42.63 63.75,42.63 U$6.3 | R74.1 13.7,87.7 R71.1 | U$35.1 47.45,38.84 R41.1
  Top 0.7: U$34.8 63.73,51 U$34.7 61.6,50.38 | 61.6,42.63 63.75,42.63 | 61.6,38.84 U$35.1
  Top 1.4: R71.1 13.2,90.95 70.75,90.95 80.85,80.85 80.85,52.34 79.51,51 63.73,51
  Top 1.6: 61.6,50.38 61.6,42.63 61.6,38.84
  pour Top (no thermals): 60.75,52 64.75,52 64.75,50 60.75,50
  pour Top (rank 2, no thermals): 51,39.4 62.5,39.4 62.5,37.5 51,37.5
INT-C  (via drill 0.35)
  Top 0.25: U$2.17 64.17,28.5 63.77,28.89 63.77,30.25 v63.67,30.35 63.67,30.66 62.42,31.91 62.42,33.23 R15.C.1 | v43,29.45 42,29.45 41.23,28.68 41.23,12.06 38.19,9.03 26.96,9.03 25.86,10.12 21.21,10.12 21.02,10.31 21.02,11.69 20.79,11.93 18.53,11.93 v18.5,11.95 | IC2.26 10.25,34.86 9.82,34.43 9.82,27.02 13.69,23.15 13.69,13.11 14.85,11.95 v15.3,11.95
  Bottom 0.25: v63.67,30.35 63.02,31 44.59,31 43.04,29.45 v43,29.45 | v18.5,11.95 v15.3,11.95
INT-D  (via drill 0.35)
  Top 0.25: U$5.17 56.84,63.5 57.23,63.11 57.23,61.76 v57.33,61.65 57.33,61.34 58.58,60.09 58.58,58.77 R15.D.1 | IC2.41 20.86,40.5 24.48,44.11 24.48,54.23 24.71,54.48 25.79,54.48 25.98,54.28 25.98,53.22 27.59,51.6 39.2,51.6 40.21,50.59 v40.25,50.59
  Bottom 0.25: v57.33,61.65 57.33,60.92 57.7,60.55 64.72,60.55 65.65,59.62 65.65,57.41 68.9,54.16 68.9,46.69 68.11,45.9 64.24,45.9 61.17,48.98 54.29,48.98 51.67,51.6 41.3,51.6 40.29,50.59 v40.25,50.59
LED
  Top 0.25: R81.1 9.25,31.35 9.25,36.5 IC2.25
N$1
  Top 0.25: IC2.5 13.25,47.65 C1.1
N$2  (via drill 0.35)
  Bottom 0.25: 54.75,43.25 54.4,42.9 v54.4,42.75
  Bottom 1.4: U$1.P$1 59.55,40.45 56.75,43.25 54.75,43.25
  other vias: 55.4,42.75 55.4,43.75 54.4,43.75
  pour Bottom (rank 2, no thermals): 53.75,42.25 56,42.25 56,44.25 53.75,44.25
  pour Top (rank 2, no thermals): 58.5,44.25 58.5,42.25 53.75,42.25 53.75,44.25
N$3  (via drill 0.35)
  Top 0.25: R31.1 65.91,40.09 U$6.1
  Bottom 0.25: v63.25,39.05 63.75,38.55 63.75,38.5
  Bottom 1.4: 63.75,38.5 U$23.P$1
  other vias: 63.25,38.05 64.25,38.05 64.25,39.05
  pour Bottom (no thermals): 64.75,37.55 62.75,37.55 62.75,39.55 64.75,39.55
  pour Top (no thermals): 62.75,40.75 64.75,40.75 64.75,37.5 62.75,37.5
N$4
  Top 0.25: TCXO.P$3 13,51.77 C1.2
N$5
  Top 0.25: U$34.4 55.2,47.84 R34.2 R4.1
N$6
  Top 0.3: U$13.1 37.6,59.65 35.05,59.65 R25.1 34.15,58.5 OPA3.P$1
N$7
  Top 0.3: U$2.13 67.25,31.8 R11.C.1 66.35,36.1 R12.C.2
N$8
  Top 0.25: U$2.8 72.04,28 72.08,28.03 72.08,30.86 73.28,32.06 73.28,32.94 74.15,33.81 R7.C.2
N$9
  Top 0.25: U$2.3 72.51,25.5 73.91,24.1 C7.C.1
N$10
  Top 0.25: U$2.10 70.35,30 70.35,33.95 R2.C.1 R1.C.2
N$11  (via drill 0.35)
  Top 0.25: R10.C.1 74.15,26 v73,26 U$2.4 | R9.C.2 71,37.8 v71.75,37.05
  Bottom 0.25: v71.75,37.05 71.75,27.25 v73,26
N$12
  Top 0.25: C8.C.1 72.53,30.68 72.53,27.85 72.18,27.5 U$2.7
N$13
  Top 0.25: R18.C.1 61.62,27.88 62.24,27.88 63.62,26.5 U$2.21
N$14
  Top 0.25: C9.2 15.4,85.25 R74.2 14.46,83.55 15.33,82.67 16.73,82.67 18.05,81.36 INA219#1.2
N$15
  Top 0.25: U$2.20 63.76,27 62.42,28.33 62.42,29.12 R19.C.1
N$16
  Top 0.25: U$2.5 72.45,26.5 R13.C.2
N$17
  Top 0.25: R81.2 7,29.15 LED.C
N$18
  Top 0.25: U$2.1 69.8,24.2 74,20 C6.C.1
N$19
  Top 0.25: R5.C.1 59.5,25.45 R8.C.1
  Top 0.3: U$2.26 65.95,23.78 65.59,23.43 64.42,23.43 63.75,22.75 C4A.C.2
  pour Top (rank 2, no thermals): 66.15,26 65.5,26 65.5,23.75 59,23.75 59,30.75 43.5,30.75 43.5,13 44.25,12.25 49.5,12.25 50.25,13 50.25,20 64.5,20 64.5,21.75 66.15,23.4
N$20
  Top 0.25: U$2.25 62.75,24.2 62.35,23.8 C5.C.2
N$21  (via drill 0.35)
  Top 0.25: C5.C.1 59.9,22.7 v59.75,22.7
  Bottom 0.25: v59.75,22.7 v59.75,19.25
  pour Top (no thermals): 66.25,26 66.8,26 66.8,23.3 65.75,22.25 65.75,19 65.25,18.5 50.25,18.5 47,21.75 47,26 47.25,26.25 52.75,26.25 53,26 53,23 56,20 64.5,20 64.5,21.75 66.25,23.5
N$22
  Top 0.25: U$2.23 64,25.5 63.6,25.1 62.35,25.1 R5.C.2 61.41,25.85 60.53,26.73 58.33,26.73 R6.C.1
N$23
  Top 0.25: R8.C.2 58.5,23.91 59.24,24.65 63.81,24.65 64.17,25 U$2.24
N$24
  Top 0.3: 3362P4.1 32.61,61.21 R22.1
N$25
  Top 0.25: 67.19,43.91 R29.2 | U$6.4 65.81,43.91 R29.2 | R29.2 R7.2
N$26
  Top 0.25: U$2.19 63.89,27.5 62.88,28.52 62.88,29.31 62.42,29.76 62.42,30.64 62.23,30.82 58.58,30.82 R17.C.1
N$27
  Top 0.25: U$2.18 64.03,28 63.33,28.7 63.33,29.5 62.88,29.95 62.88,30.82 61.7,32 R16.C.1
N$28
  Top 0.25: R35.2 54.77,50.38 U$34.2 | R35.2 54.23,50.38 | R5.1 R35.2
N$29
  Top 0.25: OPA3.P$3 30.3,55.77 30.94,55.13 30.94,53.18 30.75,52.99 29.85,52.99 29.66,53.18 29.66,55.14 28.88,55.93 28.88,68.98 33.64,73.75 3362P2.2
  Top 0.3: 3362P2.2 U$19.P$1
N$30
  Top 0.3: U$5.13 53.75,60.2 R11.D.1 54.65,55.9 R12.D.2
N$31
  Top 0.25: U$5.10 50.65,62 50.65,58.05 R2.D.1 R1.D.2
N$32  (via drill 0.35)
  Top 0.25: R10.D.1 46.85,66 v48,66 U$5.4 | R9.D.2 50,54.2 v49.25,54.95
  Bottom 0.25: v49.25,54.95 49.25,64.75 v48,66
N$33
  Top 0.25: U$5.8 48.96,64 48.92,63.97 48.92,61.14 47.73,59.94 47.73,59.06 46.85,58.19 R7.D.2
N$34
  Top 0.25: U$5.3 48.49,66.5 47.09,67.9 C7.D.1
N$35
  Top 0.25: C8.D.1 48.48,61.33 48.48,64.15 48.82,64.5 U$5.7
N$36
  Top 0.25: R18.D.1 59.38,64.12 58.76,64.12 57.38,65.5 U$5.21
N$37
  Top 0.25: U$5.20 57.24,65 58.58,63.67 58.58,62.88 R19.D.1
N$38
  Top 0.25: U$5.5 48.55,65.5 R13.D.2
N$39
  Top 0.25: U$5.1 51.2,67.8 47,72 C6.D.1
N$40
  Top 0.25: U$5.25 58.25,67.8 58.65,68.2 C5.D.2
N$41  (via drill 0.35)
  Top 0.25: C5.D.1 61.1,69.55 v61.25,69.55
  Bottom 0.25: v61.25,69.55 v61.25,72.75
  pour Top (no thermals): 54.75,66 54.2,66 54.2,68.7 55.25,69.75 55.25,73 55.75,73.5 70.75,73.5 74,70.25 74,66 73.75,65.75 68.25,65.75 68,66 68,69 65,72 56.5,72 56.5,70.25 54.75,68.5
N$42
  Top 0.25: U$5.23 57,66.5 57.4,66.9 58.65,66.9 R5.D.2 59.59,66.15 60.47,65.28 62.62,65.28 R6.D.1
N$43
  Top 0.25: R8.D.2 62.5,68.09 61.76,67.35 57.19,67.35 56.84,67 U$5.24
N$44
  Top 0.25: R5.D.1 61.5,66.55 R8.D.1
  Top 0.3: U$5.26 55.05,68.22 55.41,68.58 56.58,68.58 57.25,69.25 C4A.D.2
  pour Top (rank 2, no thermals): 54.85,66 55.5,66 55.5,68.25 62,68.25 62,61.25 77.5,61.25 77.5,79 76.75,79.75 71.5,79.75 70.75,79 70.75,72 56.5,72 56.5,70.25 54.85,68.6
N$46
  Top 0.7: U$35.5 U$35.6 U$35.7 U$35.8
N$47
  Top 0.25: U$5.19 57.11,64.5 58.12,63.48 58.12,62.69 58.58,62.24 58.58,61.37 58.77,61.17 62.48,61.17 R17.D.1
N$48  (via drill 0.35)
  Top 0.25: v58.02,46.85 55.71,46.85 55.19,46.33 37.53,46.33 36.23,47.62 34.88,47.62 34.83,47.67 | R1.2 34.83,47.67 | 34.83,47.67 35.6,48.45 R3.2 | U$36.4 77.29,43.91 76.52,43.13 76.52,42.14 77.29,41.37 U$36.2
  Top 0.3: v62.98,44.95 63.48,45.45 76.19,45.45 U$36.4
  Bottom 0.25: v58.02,46.85 59.24,48.08 60.79,48.08 62.98,45.89 v62.98,44.95
N$49
  Top 0.25: U$5.18 56.97,64 57.67,63.3 57.67,62.5 58.12,62.05 58.12,61.18 59.3,60 R16.D.1
N$50  (via drill 0.35)
  Bottom 0.25: 66.1,48.5 v66.6,48
  Bottom 1.4: U$54.P$1 66.1,51.35 66.1,48.5
  other vias: 66.6,49 65.6,49 65.6,48
  pour Top (rank 2, no thermals): 67.25,49.5 62.5,49.5 62.5,47.5 67.25,47.5
  pour Bottom (rank 2, no thermals): 67.25,49.5 65,49.5 65,47.5 67.25,47.5
N$51
  Top 0.25: R38.1 32.1,48.45 R39.1 32.39,49 33.27,48.12 34.53,48.12 34.77,48.37 34.77,49.69 34.97,49.88 36.23,49.88 36.42,49.69 36.42,48.08 37.73,46.77 42.2,46.77 U$37.4 42.83,47.84 42.05,48.62 42.05,49.61 42.83,50.38 U$37.2
N$52
  Top 0.3: R15.1 74.65,7.9 OPA2.P$1 74.55,6.61 72.94,5 69.86,5 68.65,3.8 68.65,2.67 67.83,1.85 64.85,1.85 63.44,3.25 U$29.1
N$53
  Top 0.25: 70.95,10.7 69.97,11.68 61.56,11.68 57.25,7.36 3362P6.2 U$28.P$1
  Top 0.3: 70.95,10.7 OPA2.P$4
N$54
  Top 0.25: R9.2 54.71,8.39 3362P6.3
N$55
  Top 0.25: 3362P6.1 59.79,8.39 R10.1
N$56
  Top 0.25: PFI-C.C R16.2
N$57
  Top 0.3: 3362P.3 63.56,6.85 R11.1
N$58
  Top 0.3: R12.2 72.25,6.65 72.94,7.34 72.94,8.26 72.73,8.47 71.17,8.47 70.7,8 3362P.1
N$59
  Top 0.3: R13.1 43.56,6.85 3362P1.3
N$60
  Top 0.3: R14.2 50.94,6.85 3362P1.1
N$61
  Top 0.3: U$25.P$1 3362P1.2 51,5.46 51.54,6 52.95,6 53.15,5.79 53.15,4.75 | 53.15,4.75 53.15,4.5 53,4.36 U$26.1 | 53.15,4.75
N$62
  Top 0.3: R20.1 34.15,70.06 3362P2.3
N$63
  Top 0.25: PGS-C.C R17.2
N$64
  Top 0.25: 3362P2.1 33,77 R21.2
N$65
  Top 0.25: PGB-C.C R18.2
N$66
  Top 0.25: OPA3.P$4 30.3,55.14 29.32,56.11 29.32,62.62 3362P4.2
  Top 0.3: U$10.P$1 3362P4.2
N$67
  Top 0.25: R19.2 32.61,66.29 3362P4.3
N$68
  Top 0.25: R23.2 PFI-D.C
N$69
  Top 0.25: R24.2 PGS-D.C
N$70
  Top 0.25: R26.2 PGB-D.C
N$71
  Top 0.3: U$9.P$1 U$13.2 34.01,60.5 32.26,58.75 R22.2
N$72
  Top 0.3: U$11.P$1 U$14.2 33.65,67 31.9,68.75 R19.1
N$73
  Top 0.3: R20.2 35.85,68.89 37.2,70.25 37.5,70.25 U$15.1 U$18.P$1
N$74
  Top 0.3: U$17.P$1 U$16.2 37.45,77 36.1,78.36 R21.1
N$75
  Top 0.3: U$24.P$1 U$21.2 43.75,3.5 43.75,3.79 42.4,5.15 R13.2
N$76
  Top 0.3: U$22.P$1 U$20.1 50.5,4.25 51.4,5.15 R14.1
N$77  (via drill 0.35)
  Top 0.25: R35.1 55.2,51.66 U$34.1
  Bottom 0.25: v57.75,52.7 57.25,53.2 57.25,53.25
  Bottom 1.4: 57.25,53.25 U$55.P$1
  other vias: 57.75,53.7 56.75,53.7 56.75,52.7
  pour Top (no thermals): 56.25,54.2 58.25,54.2 58.25,50.7 56.25,50.7
  pour Bottom (no thermals): 56.25,54.2 58.25,54.2 58.25,52.2 56.25,52.2
N$78
  Top 0.25: U$37.7 U$37.8 50.42,52.35 R5.2
N$79
  Top 0.25: U$36.7 U$36.8 70.67,39.5 R28.1
N$80
  Top 0.25: U$37.5 U$37.6 52.13,49.12 R4.2
N$81
  Top 0.25: U$36.5 U$36.6 68.86,42.63 R7.1
N$83
  Top 0.25: U$26.2 53.73,3.52 53.73,6.88 52.25,8.36 R9.1
  Top 0.3: U$27.P$1 U$26.2
N$86
  Top 0.25: R10.2 60.73,7.63 60.73,3.48 U$29.2
  Top 0.3: U$30.P$1 U$29.2
N$88
  Top 0.25: U$6.2 66.33,41.37 R31.2 | R31.2 66.77,41.47 | R28.2 R31.2
N$90
  Top 0.3: R43.1 32.86,13.71 3362P3.3
N$93
  Top 0.3: 3362P3.1 32.86,18.79 R44.2
N$94
  Top 0.3: 3362P3.2 U$43.P$1 38.9,17.15 38.9,21.1 U$52.1
N$95
  Top 0.3: U$35.4 51.85,42.5 50.5,42.5 | 50.5,42.5 47.5,42.5 46.61,43.39 44.49,43.39 R40.2 43.6,40.15 U$38.3 44,37.4 R41.2 | 50.5,42.5 50.5,41.15 51.53,40.12 U$35.2
N$96
  Top 0.3: U$42.P$1 U$39.1 33.9,13 32.15,11.25 R43.2
N$97
  Top 0.25: U$40.2 37.73,19.77 33.58,19.77 R44.1
  Top 0.3: U$41.P$1 U$40.2
N$98
  Top 0.3: 3362P5.3 32.86,33.71 R45.1
N$99
  Top 0.3: 3362P5.1 30.96,38.79 30.4,39.35 R46.2
N$100
  Top 0.3: 3362P5.2 U$48.P$1 38.78,36.25 39.4,36.88 39.4,42.1 OPA1.P$4
N$101
  Top 0.3: R45.2 33.6,32.75 33.65,32.75 33.9,33 U$44.1 U$47.P$1
N$102
  Top 0.3: U$46.P$1 U$45.2 37.75,39.75 34.8,39.75 33.3,41.25 R46.1
N$104
  Top 0.25: R48.1 34.4,22.56 3362P7.1
  Top 0.3: R48.1 34.4,21.5
N$105  (via drill 0.35)
  Top 0.25: v30.28,32.5 30.28,37.37 38.36,37.37 38.88,37.89 38.88,40.88 37.56,42.2 OPA1.P$3 | U$51.P$1 3362P7.2
  Bottom 0.25: 3362P7.2 30.28,26.68 v30.28,32.5
N$106
  Top 0.25: R47.2 34.4,29.94 3362P7.3
  Top 0.3: 34.4,31 R47.2
N$108
  Top 0.3: U$50.P$1 U$49.2 37.7,29.5 36.1,31.11 R47.1
N$109
  Top 0.3: U$53.P$1 U$52.2 37.75,22.75 37.45,22.75 36.1,21.39 R48.2
N$147
  Top 0.25: R73.2 18.7,83.15 INA219#1.1
  Top 0.3: C9.1 R73.2
N$150
  Top 0.25: INA219#2.1 13.25,77.52 13.7,77.07 R76.2 C10.1
N$151
  Top 0.25: 17,74.4 17,76.59 16.64,76.95 14.46,76.95 13.9,77.5 INA219#2.2 | 16.05,74.4 17,74.4 | 17,74.4 18.25,74.4
  Top 0.3: C10.2 16.05,74.4 | 18.25,74.4 R77.2
N$159
  Top 0.25: R82.2 21.8,29.15 PWR.C
NRST  (via drill 0.35)
  Top 0.25: IC2.7 12.28,45.48 12.28,41.44 17.43,36.28 17.43,33.47 v15.98,32.02 15.6,31.64 R79.2 | U$12.P$11 23,7.06 21.9,8.16 20.4,8.16 17.8,10.76 17.8,24.85 16.65,26 v16.65,28.33
  Bottom 0.25: v16.65,28.33 16.65,31.35 v15.98,32.02
PFI-C  (via drill 0.35)
  Top 0.25: R14.C.2 74.15,30.17 v73.23,29.25 73.23,27.91 72.31,27 U$2.6 | v43,32.32 42.96,32.32 39.88,29.24 39.88,12.62 37.63,10.38 27.62,10.38 26.68,11.32 26.68,14.59 25.5,15.76 PFI-C.A 24.62,18.88 18.53,18.88 v18.5,18.85 | IC2.29 11.75,34.45 11.18,33.87 11.18,27.58 15.04,23.71 15.04,19.1 v15.3,18.85
  Bottom 0.25: v73.23,29.25 73,29.02 73,27.63 74.15,26.48 74.15,24.91 73,23.76 73,17.5 66.65,17.5 66.65,30.4 64.69,32.35 43.03,32.35 v43,32.32 | v18.5,18.85 v15.3,18.85
PFI-D  (via drill 0.35)
  Top 0.25: U$5.6 48.69,65 48.02,64.34 48.02,62.92 R14.D.2 46.85,61.92 v46,62.77 | IC2.40 21,40 24.93,43.92 24.93,49.19 25.25,49.51 | v42.75,63 41.5,61.75 41.5,49.89 40.54,48.93 39.96,48.93 37.74,51.15 26.89,51.15 | 26.89,51.15 26.85,51.15 | 26.89,51.15 25.25,49.51 | PFI-D.A 25.25,49.51
  Bottom 0.25: v46,62.77 45.77,63 v42.75,63
PGB-C  (via drill 0.35)
  Top 0.25: U$2.16 64.7,29.45 v64.7,30.35 | v43,30.41 42.32,30.41 40.78,28.86 40.78,12.25 38.01,9.47 27.14,9.47 25.62,11 PGB-C.A 25.5,11.51 23.39,13.62 19.13,13.62 v18.5,14.25 | v15.3,14.25 14.14,15.4 14.14,23.34 10.28,27.21 10.28,34.24 10.75,34.72 IC2.27
  Bottom 0.25: v64.7,30.35 63.6,31.45 44.41,31.45 43.45,30.5 43.09,30.5 v43,30.41 | v18.5,14.25 v15.3,14.25
PGB-D  (via drill 0.35)
  Top 0.25: U$5.16 56.3,62.55 v56.3,61.65 | v40.25,51.54 40.21,51.54 39.71,52.05 27.78,52.05 26.43,53.4 26.43,54.47 25.97,54.92 25.25,54.92 | IC2.42 20.73,41 24.02,44.3 24.02,46.56 21.02,49.56 21.02,54.44 21.52,54.92 25.25,54.92 | PGB-D.A 25.25,54.92
  Bottom 0.25: v56.3,61.65 56.3,61.29 57.49,60.1 64.54,60.1 65.2,59.44 65.2,57.22 68.45,53.97 68.45,46.88 67.92,46.35 64.43,46.35 61.35,49.42 54.48,49.42 51.85,52.05 40.79,52.05 40.29,51.54 v40.25,51.54
PGS-C  (via drill 0.35)
  Top 0.25: U$2.15 65.95,30.1 v65.7,30.35 | v43,31.36 42.64,31.36 40.33,29.05 40.33,12.43 37.82,9.93 27.33,9.93 26.23,11.03 26.23,11.54 25.5,12.26 PGS-C.A 24.12,15.88 18.53,15.88 v18.5,15.9 | IC2.28 11.25,34.58 10.72,34.06 10.72,27.39 14.59,23.52 14.59,16.7 v15.3,16
  Bottom 0.25: v65.7,30.35 v65.69,30.35 64.14,31.9 43.58,31.9 43.04,31.36 v43,31.36 | v18.5,15.9 18.4,16 v15.3,16
PGS-D  (via drill 0.35)
  Top 0.25: U$5.15 55.05,61.9 v55.3,61.65 | v40.25,52.5 28.5,52.5 26.88,54.12 26.88,56.88 25.79,57.98 25.25,57.98 | IC2.43 20.59,41.5 23.57,44.48 23.57,46.38 21.7,48.25 20,48.25 19.32,48.92 19.32,54.44 20.27,55.38 23.18,55.38 24.52,56.72 24.52,57.78 24.71,57.98 25.25,57.98 | PGS-D.A 25.25,57.98
  Bottom 0.25: v55.3,61.65 57.3,59.65 64.35,59.65 64.75,59.25 64.75,57.04 68,53.79 68,47.06 67.74,46.8 64.61,46.8 61.54,49.88 54.66,49.88 52.04,52.5 v40.25,52.5
ROZE-1
  Top 0.25: R2.1 3.42,11.27 ROZE1.1 0.5,13.52 0.5,43.52 1.56,44.58 5.96,44.58 7.54,43 IC2.15
ROZE-2
  Top 0.25: IC2.16 7.4,42.5 5.78,44.12 1.74,44.12 0.95,43.33 0.95,19.57 ROZE2.1 2.77,17.75 R6.1
ROZE-3
  Top 0.25: IC2.17 7.27,42 5.59,43.67 1.93,43.67 1.4,43.14 1.4,25.62 ROZE3.1 7.02,20 R8.1
ROZE-4
  Top 0.25: IC2.18 7.13,41.5 5.41,43.23 2.12,43.23 1.85,42.96 1.85,31.67 ROZE4.1 3.84,29.68 3.84,26.06 R49.1
RX-S
  Top 0.25: U$12.P$4 16,23.39 11.62,27.77 11.62,30.98 12.75,32.11 IC2.31
SCL  (via drill 0.35)
  Top 0.25: INA219#2.5 15.2,80.18 v15.5,79.88 15.5,79.55 INA219#1.5 | R101.2 4.95,42.35 v5.85,41.45 5.85,41.24 7.09,40 IC2.21 | v6.6,56.75 6.6,57.75 6.96,58.11 7.87,58.11 12.25,62.5 v12.25,69
  Bottom 0.25: v5.85,41.45 7.1,42.7 7.1,49.68 8.55,51.13 8.55,52.37 7.1,53.81 7.1,54.5 7.1,56.25 v6.6,56.75 | v12.25,69 12.25,76.75 15.38,79.88 v15.5,79.88
SCLTM  (via drill 0.35)
  Top 0.25: IC2.45 17.8,42.5 18.21,42.09 18.84,42.09 v19.5,42.75 | v18.2,45.66 17.95,45.91 17.95,61.19 25.93,69.17 25.93,74.54 29.15,77.76 32.22,77.76 34.02,79.56 39.73,79.56 40.82,80.65 40.82,83.75 41.79,84.73 42.75,84.73 43.72,83.75 43.72,82.19 JP1.13
  Bottom 0.25: v19.5,42.75 19.2,43.05 19.2,44.29 18.2,45.3 v18.2,45.66
SDA  (via drill 0.35)
  Top 0.25: INA219#1.6 17.4,78.76 16.73,79.43 v16.68,79.43 16.21,79.91 16.21,81 15.54,81.67 14.87,81.67 14.55,81.36 INA219#2.6 | R102.2 v5.85,40.25 6.6,39.5 IC2.22 | v13.25,69 12.7,68.45 12.7,62.31 7.8,57.41 v7.44,57.41
  Bottom 0.25: v5.85,40.25 5.85,40.46 7.55,42.16 7.55,49.5 9,50.95 9,52.55 7.55,54 7.55,57.3 v7.44,57.41 | v16.68,79.43 16.05,79.43 15.79,79.17 15.31,79.17 12.7,76.56 12.7,69.55 v13.25,69
SDATM  (via drill 0.35)
  Top 0.25: IC2.46 18.3,43 v18.5,42.8 | v17.75,44.75 17.75,45.11 17.49,45.36 17.49,45.95 17.5,45.95 17.5,61.38 25.48,69.36 25.48,74.72 28.96,78.21 32.03,78.21 33.83,80.01 37.64,80.01 38.64,81.02 38.64,84.09 39.73,85.18 43.27,85.18 JP1.14
  Bottom 0.25: v18.5,42.8 17.75,43.55 v17.75,44.75
SWC
  Top 0.25: IC2.37 17.88,37.38 17.88,31.02 R27.2 16.82,29.98 12.81,29.98 12.62,29.79 12.62,28.52 12.81,28.32 13.69,28.32 17.35,24.67 17.35,10.57 20.21,7.71 21.71,7.71 22,7.42 U$12.P$10
SWD
  Top 0.25: U$12.P$8 20,7.29 16.9,10.39 16.9,24.48 13.5,27.88 12.63,27.88 12.18,28.33 12.18,29.97 13.05,30.85 R64.2 13.5,35.25 14.25,36 IC2.34
TIME
  Top 0.25: JP1.15 45.9,82.55 45.9,84.09 44.31,85.68 29.43,85.68 27.58,83.83 27.58,81.92 21.77,76.11 21.77,70.75 3.75,52.72 3.75,50.48 8.25,45.98 IC2.13
TX-S  (via drill 0.35)
  Top 0.25: v12.05,33.75 12.25,33.95 IC2.30 | U$12.P$6 18,8.65 16.45,10.2 16.45,23.93 v13.57,26.82
  Bottom 0.25: v13.57,26.82 12.05,28.34 v12.05,33.75
VB-C  (via drill 0.35)
  Top 0.25: C2A.C.1 68.35,17.05 C2B.C.1 67.9,19.2 U$2.29
  Top 0.3: R12.C.1 66.7,33.1 67.9,31.9 U$2.12 U$2.29
  Bottom 1.4: U$23.P$2 66.2,33.9 v66.8,33.3
  other vias: 68.25,30.85 68.25,31.8 67.55,32.55 69.1,21.2 68.1,21.2 68.1,20.2 69.1,20.2 70.1,20.2 70.1,19.2 70.1,18.2
  pour Top (no thermals): 67.5,27.5 67.5,31.75 65.25,34 65.25,34.75 65.75,35.25 67.3,35.25 67.3,33.45 69,31.75 69,30.75 68.15,29.9 68.15,27.5
  pour Top (no thermals): 67.7,26 67.7,15.5 70.5,15.5 70.5,20.25 68.05,22.7 68.05,26
  pour Bottom (no thermals): 70.5,17.75 67.1,17.75 67.1,31.65 65.75,33 67,34.25 68.75,32.5 68.75,22 70.5,20.25
VB-D  (via drill 0.35)
  Top 0.25: C2A.D.1 52.65,74.95 C2B.D.1 53.1,72.8 U$5.29
  Top 0.3: R12.D.1 54.3,58.9 53.1,60.1 U$5.12 U$5.29
  Bottom 1.4: v54.2,58.7 55.05,57.85 U$55.P$2
  other vias: 52.75,61.15 52.75,60.2 53.45,59.45 51.9,70.8 52.9,70.8 52.9,71.8 51.9,71.8 50.9,71.8 50.9,72.8 50.9,73.8
  pour Top (no thermals): 53.5,64.5 53.5,60.25 55.75,58 55.75,57.25 55.25,56.75 53.7,56.75 53.7,58.55 52,60.25 52,61.25 52.85,62.1 52.85,64.5
  pour Top (no thermals): 53.3,66 53.3,76.5 50.5,76.5 50.5,71.75 52.95,69.3 52.95,66
  pour Bottom (no thermals): 50.5,74.25 53.9,74.25 53.9,60.1 55.12,58.88 54,57.75 52.25,59.5 52.25,70 50.5,71.75
VBO-C
  pour Top (rank 3, no thermals): 67,27.5 66.25,27.5 66.25,31 43.5,31 43.5,38.65 67,38.65
VBO-D
  pour Top (rank 3, no thermals): 54,64.5 54.75,64.5 54.75,61 77.5,61 77.5,53.35 54,53.35
VCC-C  (via drill 0.35)
  Top 0.25: 58.1,32 R16.C.2 R15.C.2 | R14.C.1 74.99,31.11 v74.99,31.27
  Bottom 0.25: v74.99,31.27 73.78,31.27 72.2,29.7 72.2,27.79 73.7,26.29 73.7,25.46 v72.5,24.25 71.28,25.48 71.28,34.02 66.95,38.35 66.95,40.62 66.1,41.48 59.98,41.48 56.7,44.75 53.2,44.75 53.2,41.7 57.5,37.4 v57.5,34.35 v58.5,34.35
  other vias: 58.5,33.35 57.5,33.35
  pour Bottom (no thermals): 56.75,32.75 56.75,35 59.25,35 59.25,32.75
  pour Top (no thermals): 60.75,31.25 56.75,31.25 56.75,35 60.75,35
  pour Top (no thermals): 69,24.5 69,25.5 72.5,25.5 75,23 75,20.75 73.25,20.75 69.5,24.5
VCC-D  (via drill 0.35)
  Top 0.25: R17.D.2 62.9,60 R16.D.2 R15.D.2 | R14.D.1 46.01,60.89 v46.01,60.73
  Bottom 0.25: v46.01,60.73 47.23,60.73 48.8,62.3 48.8,64.21 47.3,65.71 47.3,66.54 v48.5,67.75 49.73,66.53 49.73,57.98 54.05,53.65 54.05,51.17 54.9,50.33 61.73,50.33 64.8,47.25 67.55,47.25 67.55,53.6 v63.5,57.65 v62.5,57.65
  other vias: 62.5,58.65 63.5,58.65
  pour Top (no thermals): 52,67.5 52,66.5 48.5,66.5 46,69 46,71.25 47.75,71.25 51.5,67.5
  pour Top (no thermals): 60.25,60.75 64.25,60.75 64.25,57 60.25,57
  pour Bottom (no thermals): 64.25,59.25 64.25,57 61.75,57 61.75,59.25
VIN-C  (via drill 0.35)
  Top 0.25: R9.C.1 68.75,37.65 R1.C.1 67.88,36.1 | 67.88,36.1 67.88,33.27 69.25,31.89 69.25,30.75 | R11.C.2 65,36.1 65.83,36.92 67.88,36.92 67.88,36.1
  Top 0.3: 69.25,30.75 68.55,30.05 U$2.11 U$2.30
  Bottom 1.4: v69.5,33.35 65.67,37.17 65.67,40.45 U$1.P$2
  other vias: 69.5,30.35 69.5,31.35 69.5,32.35 72.2,18.2 71.2,18.2 72.2,19.2 71.2,19.2 72.2,20.2 71.2,20.2 71.2,21.2
  pour Top (rank 2, no thermals): 68.3,27.5 68.85,27.5 68.85,29.75 70.1,29.75 70.1,38.65 64,38.65 64,35.35 67.8,35.35 67.8,33.15 69.1,31.85 69.1,30.85 68.3,30.05
  pour Top (rank 2, no thermals): 68.25,26 68.25,22.75 70.5,20.5 70.5,15.5 77.5,15.5 78,16 78,19 74.75,19 68.75,25 68.75,26
  pour Bottom (rank 2, no thermals): 72.75,17.75 70.75,17.75 70.75,20.5 69,22.25 69,33.75 70.5,33.75 70.5,23 72.75,20.75
VIN-D  (via drill 0.35)
  Top 0.25: R9.D.1 52.25,54.35 R1.D.1 53.12,55.9 | 53.12,55.9 53.12,58.73 51.75,60.11 51.75,61.25 | R11.D.2 56,55.9 55.17,55.08 53.12,55.08 53.12,55.9
  Top 0.3: 51.75,61.25 52.45,61.95 U$5.11 U$5.30
  Bottom 1.4: v51.5,58.65 55.33,54.83 55.33,51.35 U$54.P$2
  other vias: 51.5,61.65 51.5,60.65 51.5,59.65 48.8,73.8 49.8,73.8 48.8,72.8 49.8,72.8 48.8,71.8 49.8,71.8 49.8,70.8
  pour Top (rank 2, no thermals): 52.7,64.5 52.15,64.5 52.15,62.25 50.9,62.25 50.9,53.35 57,53.35 57,56.65 53.2,56.65 53.2,58.85 51.9,60.15 51.9,61.15 52.7,61.95
  pour Top (rank 2, no thermals): 52.75,66 52.75,69.25 50.5,71.5 50.5,76.5 43.5,76.5 43,76 43,73 46.25,73 52.25,67 52.25,66
  pour Bottom (rank 2, no thermals): 48.25,74.25 50.25,74.25 50.25,71.5 52,69.75 52,58.25 50.5,58.25 50.5,69 48.25,71.25
Y
  Top 0.3: INVERT1.P$4 32.95,45.85 34.55,45.85 35.45,46.75 R1.1

## Text on the board
tNames: FBB-D | DISCHARGE DC-DC | DC-DC`s CONTROL | CHARGE DC-DC | FBB-C